# EAGLE design loom_motordriver (EAGLE 9.6.0)
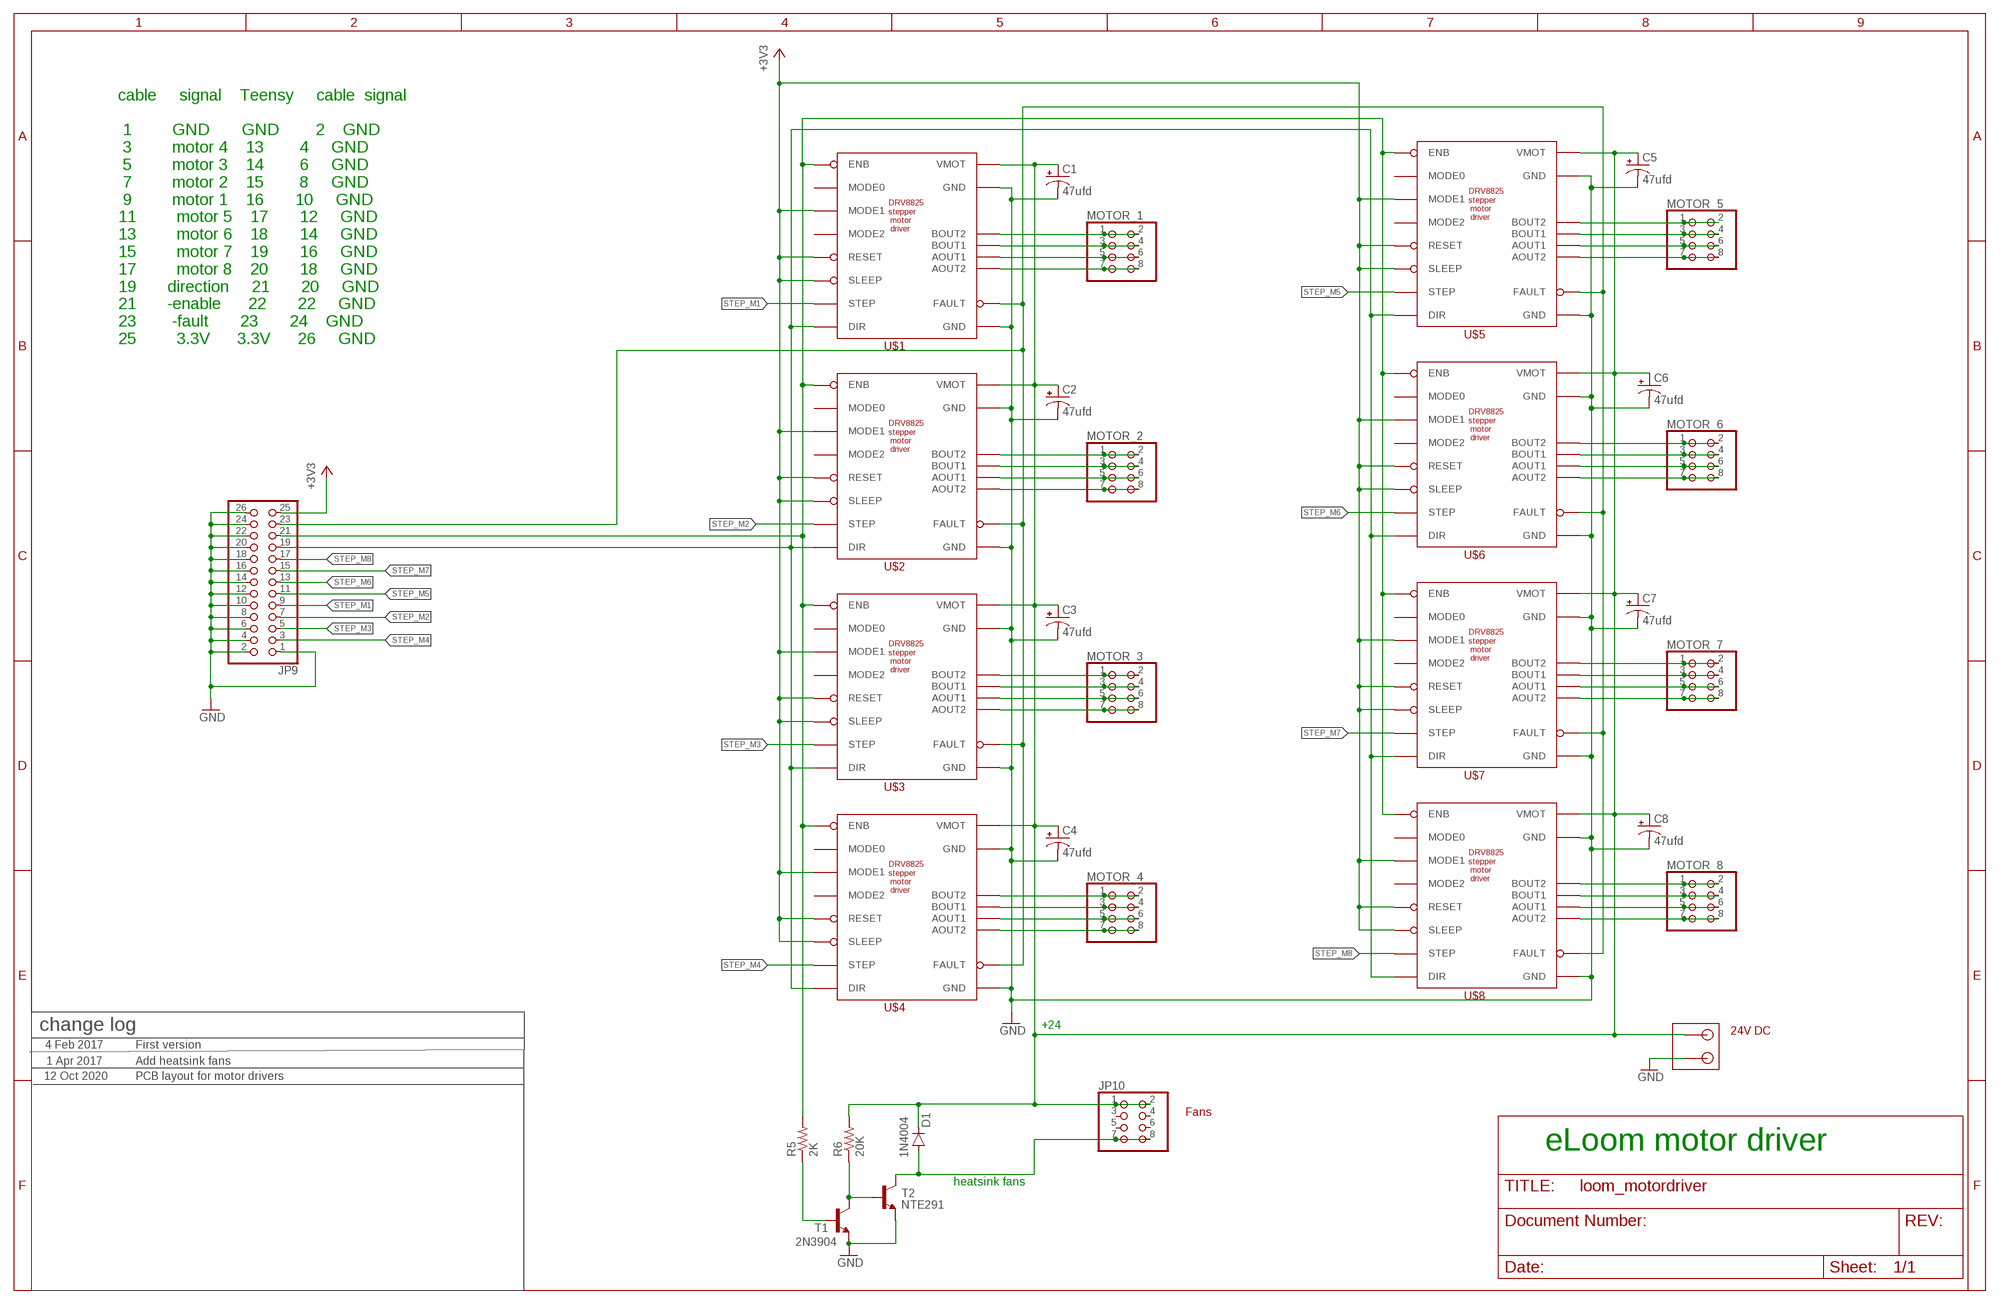
[diagram p0: schematic, sheet 1]

## Parts
C1  47ufd  CPOL-USE2.5-6  [E2,5-6]
C2  47ufd  CPOL-USE2.5-6  [E2,5-6]
C3  47ufd  CPOL-USE2.5-6  [E2,5-6]
C4  47ufd  CPOL-USE2.5-6  [E2,5-6]
C5  47ufd  CPOL-USE2.5-6  [E2,5-6]
C6  47ufd  CPOL-USE2.5-6  [E2,5-6]
C7  47ufd  CPOL-USE2.5-6  [E2,5-6]
C8  47ufd  CPOL-USE2.5-6  [E2,5-6]
D1  1N4004  [DO41-10]
JP9  PINHD-2X13  [2X13]
JP10  PINHD-2X4  [2X04]
MOTOR_1  PINHD-2X4  [2X04]
MOTOR_2  PINHD-2X4  [2X04]
MOTOR_3  PINHD-2X4  [2X04]
MOTOR_4  PINHD-2X4  [2X04]
MOTOR_5  PINHD-2X4  [2X04]
MOTOR_6  PINHD-2X4  [2X04]
MOTOR_7  PINHD-2X4  [2X04]
MOTOR_8  PINHD-2X4  [2X04]
R5  2K  R-US_0204/7  [0204/7]
R6  20K  R-US_0204/7  [0204/7]
T1  2N3904  [TO92]
T2  NTE291  -NPN-TO220  [TO220]
U$1  DRV8825_STEPPER_MOTOR_DRIVER  [DRV8825_STEPPER_MOTOR_DRIVER]
U$2  DRV8825_STEPPER_MOTOR_DRIVER  [DRV8825_STEPPER_MOTOR_DRIVER]
U$3  DRV8825_STEPPER_MOTOR_DRIVER  [DRV8825_STEPPER_MOTOR_DRIVER]
U$4  DRV8825_STEPPER_MOTOR_DRIVER  [DRV8825_STEPPER_MOTOR_DRIVER]
U$5  DRV8825_STEPPER_MOTOR_DRIVER  [DRV8825_STEPPER_MOTOR_DRIVER]
U$6  DRV8825_STEPPER_MOTOR_DRIVER  [DRV8825_STEPPER_MOTOR_DRIVER]
U$7  DRV8825_STEPPER_MOTOR_DRIVER  [DRV8825_STEPPER_MOTOR_DRIVER]
U$8  DRV8825_STEPPER_MOTOR_DRIVER  [DRV8825_STEPPER_MOTOR_DRIVER]
U$9  CONNECTOR-2PIN  [CONNECTOR-2PIN-5MM]

## Nets
24V [power]: C1.+ C2.+ C3.+ C4.+ C5.+ C6.+ C7.+ C8.+ D1.C JP10.1 JP10.2 R6.2 U$1.P$16(VMOT) U$2.P$16(VMOT) U$3.P$16(VMOT) U$4.P$16(VMOT) U$5.P$16(VMOT) U$6.P$16(VMOT) U$7.P$16(VMOT) U$8.P$16(VMOT) U$9.P$1
+3V3: JP9.25 U$1.P$3(MODE1) U$1.P$5(RESET) U$1.P$6(SLEEP) U$2.P$3(MODE1) U$2.P$5(RESET) U$2.P$6(SLEEP) U$3.P$3(MODE1) U$3.P$5(RESET) U$3.P$6(SLEEP) U$4.P$3(MODE1) U$4.P$5(RESET) U$4.P$6(SLEEP) U$5.P$3(MODE1) U$5.P$5(RESET) U$5.P$6(SLEEP) U$6.P$3(MODE1) U$6.P$5(RESET) U$6.P$6(SLEEP) U$7.P$3(MODE1) U$7.P$5(RESET) U$7.P$6(SLEEP) U$8.P$3(MODE1) U$8.P$5(RESET) U$8.P$6(SLEEP)
DIR: JP9.19 U$1.P$8(DIR) U$2.P$8(DIR) U$3.P$8(DIR) U$4.P$8(DIR) U$5.P$8(DIR) U$6.P$8(DIR) U$7.P$8(DIR) U$8.P$8(DIR)
ENB: JP9.21 R5.2 U$1.P$1(ENB) U$2.P$1(ENB) U$3.P$1(ENB) U$4.P$1(ENB) U$5.P$1(ENB) U$6.P$1(ENB) U$7.P$1(ENB) U$8.P$1(ENB)
FAN [power]: D1.A JP10.7 JP10.8 T2.2(C)
FAULT: JP9.23 U$1.P$10(FAULT) U$2.P$10(FAULT) U$3.P$10(FAULT) U$4.P$10(FAULT) U$5.P$10(FAULT) U$6.P$10(FAULT) U$7.P$10(FAULT) U$8.P$10(FAULT)
GND [power]: C1.- C2.- C3.- C4.- C5.- C6.- C7.- C8.- JP9.1 JP9.2 JP9.4 JP9.6 JP9.8 JP9.10 JP9.12 JP9.14 JP9.16 JP9.18 JP9.20 JP9.22 JP9.24 JP9.26 T1.3(E) T2.3(E) U$1.P$9(GND) U$1.P$15(GND) U$2.P$9(GND) U$2.P$15(GND) U$3.P$9(GND) U$3.P$15(GND) U$4.P$9(GND) U$4.P$15(GND) U$5.P$9(GND) U$5.P$15(GND) U$6.P$9(GND) U$6.P$15(GND) U$7.P$9(GND) U$7.P$15(GND) U$8.P$9(GND) U$8.P$15(GND) U$9.P$2
N$1 [power]: MOTOR_5.1 MOTOR_5.2 U$5.P$14(BOUT2)
N$2 [power]: MOTOR_5.3 MOTOR_5.4 U$5.P$13(BOUT1)
N$3 [power]: MOTOR_5.5 MOTOR_5.6 U$5.P$12(AOUT1)
N$4 [power]: MOTOR_5.7 MOTOR_5.8 U$5.P$11(AOUT2)
N$5 [power]: MOTOR_6.1 MOTOR_6.2 U$6.P$14(BOUT2)
N$6 [power]: MOTOR_6.3 MOTOR_6.4 U$6.P$13(BOUT1)
N$7 [power]: MOTOR_6.5 MOTOR_6.6 U$6.P$12(AOUT1)
N$8 [power]: MOTOR_6.7 MOTOR_6.8 U$6.P$11(AOUT2)
N$9 [power]: MOTOR_7.1 MOTOR_7.2 U$7.P$14(BOUT2)
N$10 [power]: MOTOR_7.3 MOTOR_7.4 U$7.P$13(BOUT1)
N$11 [power]: MOTOR_7.5 MOTOR_7.6 U$7.P$12(AOUT1)
N$12 [power]: MOTOR_7.7 MOTOR_7.8 U$7.P$11(AOUT2)
N$13 [power]: MOTOR_8.1 MOTOR_8.2 U$8.P$14(BOUT2)
N$14 [power]: MOTOR_8.3 MOTOR_8.4 U$8.P$13(BOUT1)
N$15 [power]: MOTOR_8.5 MOTOR_8.6 U$8.P$12(AOUT1)
N$16 [power]: MOTOR_8.7 MOTOR_8.8 U$8.P$11(AOUT2)
N$17 [power]: MOTOR_1.1 MOTOR_1.2 U$1.P$14(BOUT2)
N$21 [power]: MOTOR_1.3 MOTOR_1.4 U$1.P$13(BOUT1)
N$22 [power]: MOTOR_1.5 MOTOR_1.6 U$1.P$12(AOUT1)
N$23 [power]: MOTOR_1.7 MOTOR_1.8 U$1.P$11(AOUT2)
N$24 [power]: MOTOR_2.1 MOTOR_2.2 U$2.P$14(BOUT2)
N$25 [power]: MOTOR_2.3 MOTOR_2.4 U$2.P$13(BOUT1)
N$26 [power]: MOTOR_2.5 MOTOR_2.6 U$2.P$12(AOUT1)
N$27 [power]: MOTOR_2.7 MOTOR_2.8 U$2.P$11(AOUT2)
N$28 [power]: MOTOR_3.1 MOTOR_3.2 U$3.P$14(BOUT2)
N$29 [power]: MOTOR_3.3 MOTOR_3.4 U$3.P$13(BOUT1)
N$30 [power]: MOTOR_3.5 MOTOR_3.6 U$3.P$12(AOUT1)
N$31 [power]: MOTOR_3.7 MOTOR_3.8 U$3.P$11(AOUT2)
N$33: R5.1 T1.2(B)
N$34: R6.1 T1.1(C) T2.1(B)
N$37 [power]: MOTOR_4.1 MOTOR_4.2 U$4.P$14(BOUT2)
N$38 [power]: MOTOR_4.3 MOTOR_4.4 U$4.P$13(BOUT1)
N$39 [power]: MOTOR_4.5 MOTOR_4.6 U$4.P$12(AOUT1)
N$40 [power]: MOTOR_4.7 MOTOR_4.8 U$4.P$11(AOUT2)
STEP_M1: JP9.9 U$1.P$7(STEP)
STEP_M2: JP9.7 U$2.P$7(STEP)
STEP_M3: JP9.5 U$3.P$7(STEP)
STEP_M4: JP9.3 U$4.P$7(STEP)
STEP_M5: JP9.11 U$5.P$7(STEP)
STEP_M6: JP9.13 U$6.P$7(STEP)
STEP_M7: JP9.15 U$7.P$7(STEP)
STEP_M8: JP9.17 U$8.P$7(STEP)
Unconnected: JP10.3 JP10.4 JP10.5 JP10.6 U$1.P$2(MODE0) U$1.P$4(MODE2) U$2.P$2(MODE0) U$2.P$4(MODE2) U$3.P$2(MODE0) U$3.P$4(MODE2) U$4.P$2(MODE0) U$4.P$4(MODE2) U$5.P$2(MODE0) U$5.P$4(MODE2) U$6.P$2(MODE0) U$6.P$4(MODE2) U$7.P$2(MODE0) U$7.P$4(MODE2) U$8.P$2(MODE0) U$8.P$4(MODE2)

## Notes on the sheet
- cable     signal    Teensy     cable  signal
  
   1         GND       GND        2    GND  
   3         motor 4    13        4     GND
   5         motor 3    14        6     GND
   7         motor 2    15        8     GND
   9         motor 1    16       10     GND
  11         motor 5    17       12     GND
  13         motor 6    18       14     GND
  15         motor 7    19       16     GND
  17         motor 8    20       18     GND
  19       direction     21       20     GND
  21       -enable      22       22     GND
  23        -fault       23       24    GND
  25         3.3V      3.3V      26     GND
- change log | +24
- 24V DC
- 4 Feb 2017 | First version
- 1 Apr 2017 | Add heatsink fans
- 12 Oct 2020 | PCB layout for motor drivers
- Fans
- eLoom motor driver
- heatsink fans

## Library data of the parts
C1-C8 = adafruit:CPOL-US: POLARIZED CAPACITOR, American symbol
D1 = diode:1N4004: DIODE general purpose rectifier, 1 A
JP9 = pinhead:PINHD-2X13: PIN HEADER
JP10 = pinhead:PINHD-2X4: PIN HEADER
MOTOR_1-MOTOR_8 = adafruit:PINHD-2X4: PIN HEADER
R5 R6 = adafruit:R-US_: RESISTOR, American symbol
T1 = transistor:2N3904: NPN TRANSISTOR
T2 = transistor:*-NPN-: NPN Transistror BF959 corrected 2008.03.06
U$1-U$8 = Len:DRV8825_STEPPER_MOTOR_DRIVER
U$9 = Len:CONNECTOR-2PIN

## Net classes
1 power: width 1.524 mm

## Board
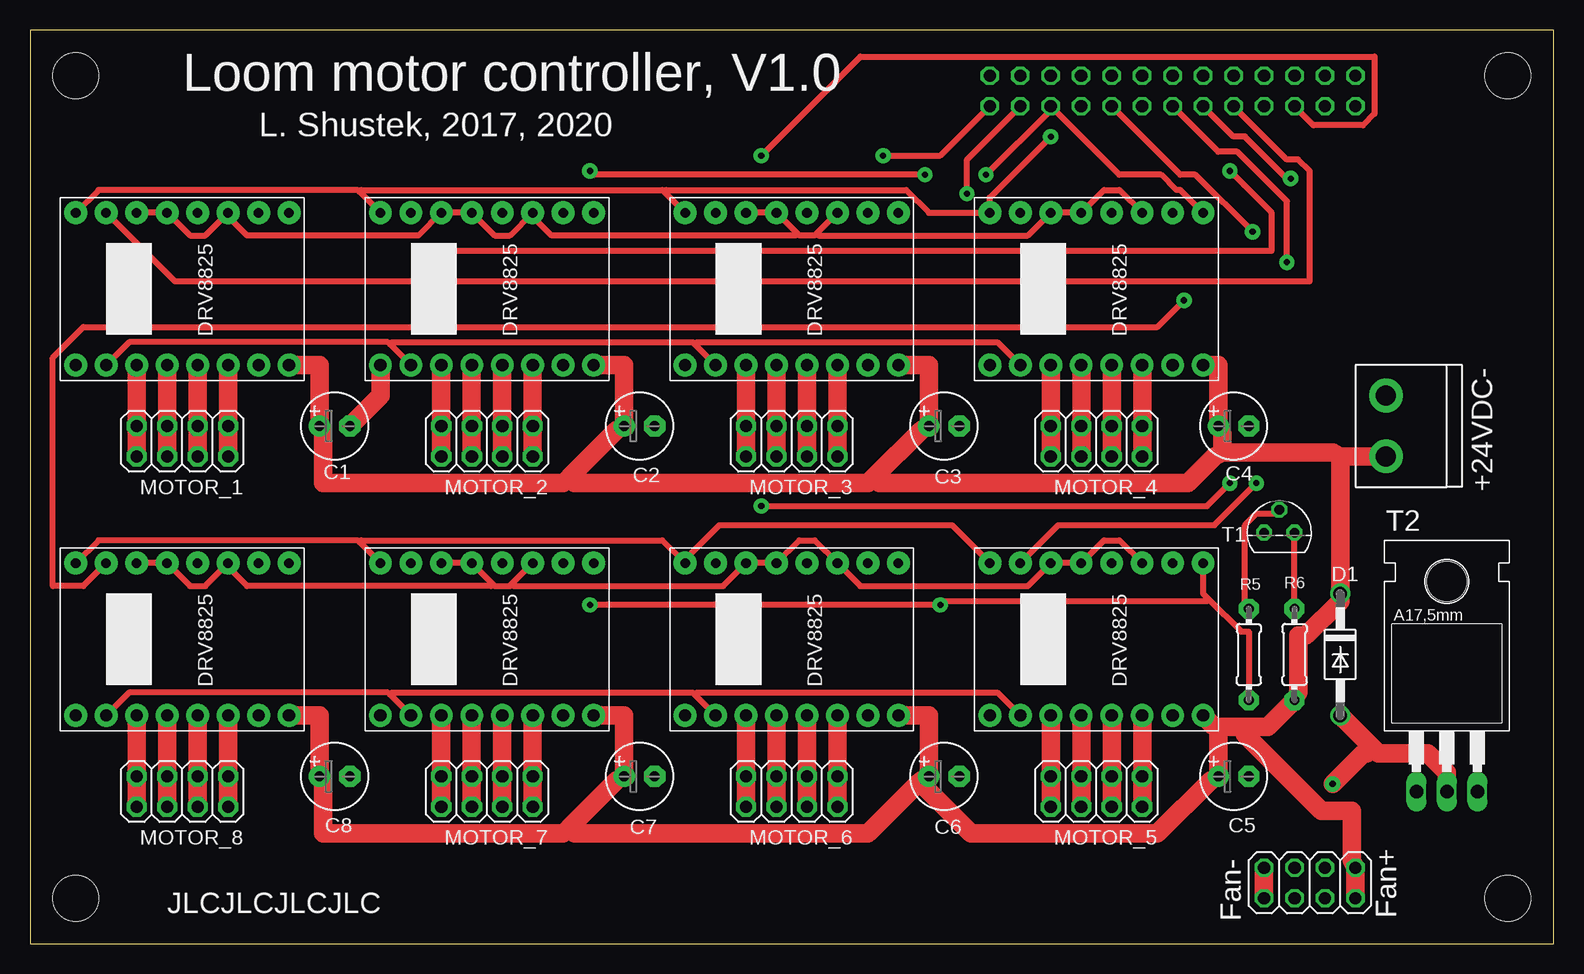
[diagram p1: board, top side]
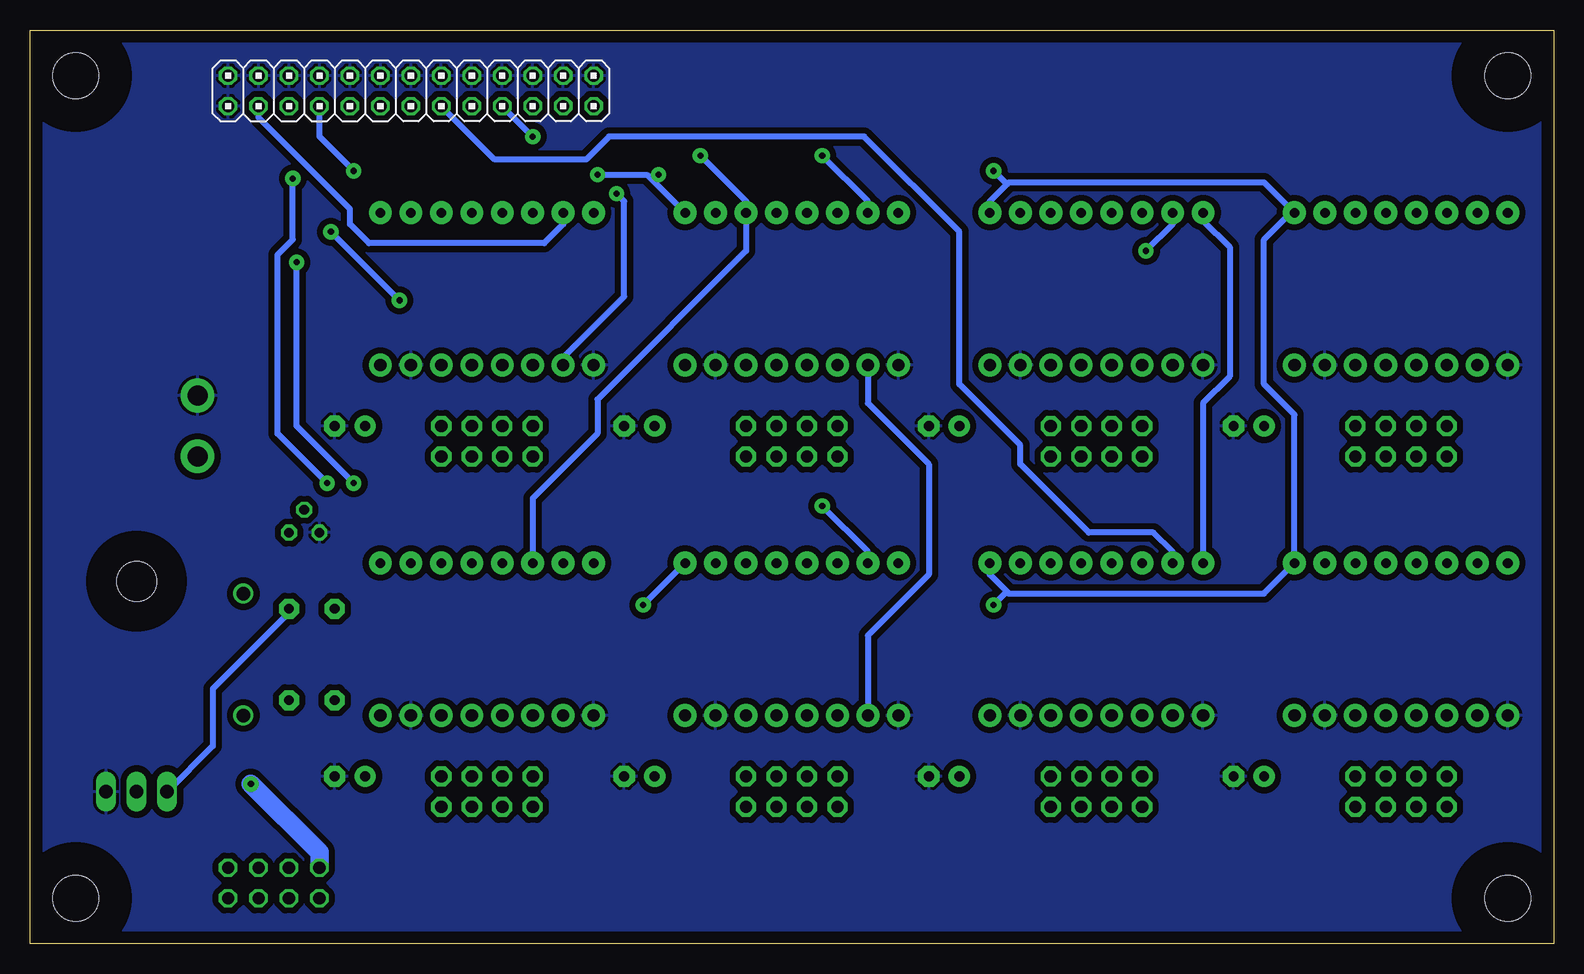
[diagram p2: board, bottom side, seen from below]

Size 127 x 76.2 mm. Coordinates in mm from the lower left corner, seen from the top.
Outline: 0,0 127,0 127,76.2 0,76.2 0,0
Copper layers (1*16): Top 0.035mm / dielectric 1.5mm / Bottom 0.035mm
Design rules "default *": minimum track width 20mil, minimum drill 20mil, track to track 20mil, track to pad 20mil, pad to pad 20mil, via to via 20mil, smd to smd 6mil, copper to edge 40mil, drill to drill 6mil, minimum pad ring 10mil, minimum via ring 15mil, stop-mask expansion 4mil, vias tented up to drill 0mil, thermal gap 10mil
Holes 3.81 mm at 3.81,3.81 3.81,72.39 123.19,72.39 123.19,3.81
tRestrict: area -0.8,67.8 to 8.4,77; area -0.8,-0.8 to 8.4,8.4; area 118.6,67.8 to 127.8,77; area 118.6,-0.8 to 127.8,8.4
bRestrict: area -0.8,67.8 to 8.4,77; area -0.8,-0.8 to 8.4,8.4; area 118.6,67.8 to 127.8,77; area 118.6,-0.8 to 127.8,8.4

### Footprints (pad centres in the part's own frame; a part is rotated, then mirrored left to right if it is on the bottom)
E2,5-6 = drill 0.813 pad 1.778: + -1.27,0 | drill 0.813 pad 1.778 octagon: - 1.27,0
DO41-10 = drill 1.118: A 5.08,0; C -5.08,0
2X13 = drill 1.016 octagon: 1 -15.24,-1.27; 2 -15.24,1.27; 3 -12.7,-1.27; 4 -12.7,1.27; 5 -10.16,-1.27; 6 -10.16,1.27; 7 -7.62,-1.27; 8 -7.62,1.27; 9 -5.08,-1.27; 10 -5.08,1.27; 11 -2.54,-1.27; 12 -2.54,1.27; 13 0,-1.27; 14 0,1.27; 15 2.54,-1.27; 16 2.54,1.27; 17 5.08,-1.27; 18 5.08,1.27; 19 7.62,-1.27; 20 7.62,1.27; 21 10.16,-1.27; 22 10.16,1.27; 23 12.7,-1.27; 24 12.7,1.27; 25 15.24,-1.27; 26 15.24,1.27
2X04 = drill 1.016 octagon: 1 -3.81,-1.27; 2 -3.81,1.27; 3 -1.27,-1.27; 4 -1.27,1.27; 5 1.27,-1.27; 6 1.27,1.27; 7 3.81,-1.27; 8 3.81,1.27
2X04' = drill 1.016 pad 1.676 octagon: 1 -3.81,-1.27; 2 -3.81,1.27; 3 -1.27,-1.27; 4 -1.27,1.27; 5 1.27,-1.27; 6 1.27,1.27; 7 3.81,-1.27; 8 3.81,1.27
0204/7 = drill 0.813 pad 1.676 octagon: 1 -3.81,0; 2 3.81,0
TO92 = drill 0.813 octagon: 1 1.27,0; 2 0,1.905; 3 -1.27,0
TO220 = drill 1.118 long: 1 -2.54,-6.35; 2 0,-6.35; 3 2.54,-6.35 | hole 3.302: 0,11.176
DRV8825_STEPPER_MOTOR_DRIVER = drill 0.8 pad 1.905: P$1 -6.35,8.89; P$2 -6.35,6.35; P$3 -6.35,3.81; P$4 -6.35,1.27; P$5 -6.35,-1.27; P$6 -6.35,-3.81; P$7 -6.35,-6.35; P$8 -6.35,-8.89 | drill 1.016 pad 1.905: P$9 6.35,-8.89; P$10 6.35,-6.35; P$11 6.35,-3.81; P$12 6.35,-1.27; P$13 6.35,1.27; P$14 6.35,3.81; P$15 6.35,6.35; P$16 6.35,8.89
CONNECTOR-2PIN-5MM = drill 1.651 pad 2.794: P$1 0,2.54; P$2 0,-2.54

### Placement (x,y rotation side)
C1  25.4,43.18 0 top
C2  50.8,43.18 0 top
C3  76.2,43.18 0 top
C4  100.33,43.18 0 top
C5  100.33,13.97 0 top
C6  76.2,13.97 0 top
C7  50.8,13.97 0 top
C8  25.4,13.97 0 top
D1  109.22,24.13 270 top
JP9  95.25,71.12 0 bottom
JP10  106.68,5.08 180 top
MOTOR_1  [2X04']  12.7,41.91 180 top
MOTOR_2  [2X04']  38.1,41.91 180 top
MOTOR_3  [2X04']  63.5,41.91 180 top
MOTOR_4  [2X04']  88.9,41.91 180 top
MOTOR_5  [2X04']  88.9,12.7 180 top
MOTOR_6  [2X04']  63.5,12.7 180 top
MOTOR_7  [2X04']  38.1,12.7 180 top
MOTOR_8  [2X04']  12.7,12.7 180 top
R5  101.6,24.13 270 top
R6  105.41,24.13 270 top
T1  104.14,34.29 0 top
T2  118.11,19.05 0 top
U$1  12.7,54.61 270 top
U$2  38.1,54.61 270 top
U$3  63.5,54.61 270 top
U$4  88.9,54.61 270 top
U$5  88.9,25.4 270 top
U$6  63.5,25.4 270 top
U$7  38.1,25.4 270 top
U$8  12.7,25.4 270 top
U$9  113.03,43.18 180 top

### Tracks (layer width: path | path; a pad name or v marks a point on that pad's centre or on a via)
24V
  Top 1.524: U$6.P$16 74.93,19.05 C6.+ 74.3,13.65 74.14,13.49 | U$8.P$16 24.13,19.05 C8.+ 24.45,13.34 24.45,9.21 44.45,9.21 44.93,9.68 | U$7.P$16 49.53,19.05 C7.+ 48.9,13.65 44.93,9.68 | 74.14,13.49 69.85,9.21 45.4,9.21 44.93,9.68 | JP10.2 JP10.1 110.17,6.99 110.17,11.11 107.63,11.11 101.28,17.46 101.28,18.1 | 99.06,18.1 98.74,18.1 U$5.P$16 | 99.06,18.1 101.28,18.1 | 101.28,18.1 103.19,18.1 R6.2 105.73,20.95 105.73,25.72 106.36,25.72 109.22,28.57 D1.C 109.22,40.64 | 99.06,18.1 C5.+ 98.42,13.65 93.98,9.21 78.42,9.21 74.14,13.49 | U$4.P$16 99.06,48.26 C4.+ 99.38,42.55 99.38,40.96 | U$9.P$1 109.22,40.64 | 99.38,40.96 108.58,40.96 109.22,40.64 | U$3.P$16 74.93,48.26 C3.+ 74.3,42.86 70.33,38.89 | U$1.P$16 24.13,48.26 C1.+ 24.45,42.55 24.45,38.42 44.45,38.42 44.93,38.89 | U$2.P$16 49.53,48.26 C2.+ 48.9,42.86 44.93,38.89 | 70.33,38.89 69.85,38.42 45.4,38.42 44.93,38.89 | 99.38,40.96 98.74,40.64 96.52,38.42 70.8,38.42 70.33,38.89
+3V3  (via drill 0.51)
  Top 0.508: U$5.P$3 90.81,33.66 89.53,33.66 U$5.P$5 U$5.P$6 83.19,29.84 69.22,29.84 U$6.P$3 65.41,33.66 64.14,33.66 U$6.P$5 U$6.P$6 57.78,29.84 40.32,29.84 40.16,30 | U$8.P$6 U$8.P$5 13.34,29.84 14.61,29.84 U$8.P$3 16.51,31.43 18.1,29.84 38.42,29.84 38.58,30 | U$7.P$6 U$7.P$5 38.58,30 | 40.16,30 40.01,29.84 38.73,29.84 38.58,30 | 40.16,30 U$7.P$3 | U$1.P$6 U$1.P$5 13.34,59.05 14.61,59.05 U$1.P$3 16.51,60.64 18.1,59.05 32.38,59.05 U$2.P$6 U$2.P$5 38.73,59.05 40.01,59.05 U$2.P$3 41.91,60.64 43.5,59.05 63.82,59.05 63.98,59.21 | U$4.P$3 90.81,62.87 89.53,62.87 U$4.P$5 U$4.P$6 83.19,59.05 65.72,59.05 65.56,59.21 | U$3.P$6 U$3.P$5 63.98,59.21 | JP9.25 75.88,65.72 v71.12,65.72 | 63.98,59.21 64.14,59.05 65.41,59.05 65.56,59.21 | U$3.P$3 65.56,59.21
  Bottom 0.508: v71.12,65.72 67.31,61.91 U$3.P$3 67.31,57.78 79.69,45.4 79.69,42.55 85.09,37.15 U$5.P$6
DIR  (via drill 0.51)
  Top 0.508: U$8.P$8 5.71,33.66 27.3,33.66 27.46,33.5 | U$7.P$8 27.46,33.5 | 27.46,33.5 27.62,33.66 52.7,33.66 U$6.P$8 54.61,32.07 57.47,34.92 76.83,34.92 U$5.P$8 | v85.09,67.31 80.01,62.23 U$4.P$8 74.93,60.96 73.03,62.87 53.02,62.87 52.86,62.71 | U$1.P$8 5.71,62.87 27.3,62.87 27.46,62.71 | U$2.P$8 27.46,62.71 | 52.86,62.71 52.7,62.87 27.62,62.87 27.46,62.71 | 52.86,62.71 U$3.P$8
  Bottom 0.508: v85.09,67.31 JP9.19 | U$7.P$8 29.21,45.09 26.99,47.31 26.99,58.1 29.21,60.33 U$2.P$8
ENB  (via drill 0.51)
  Top 0.508: U$4.P$1 95.89,62.87 95.57,62.87 94.3,64.14 90.81,64.14 JP9.21 85.09,69.53 v79.69,64.14 | v46.67,64.45 46.99,64.14 v74.61,64.14 | R5.2 101.6,26.04 100.97,26.04 98.27,28.73 | 98.27,28.73 97.79,29.21 U$5.P$1 | 98.27,28.73 98.11,28.57 76.2,28.57 v75.88,28.26 v46.67,28.26
  Bottom 0.508: 45.56,63.34 46.99,61.91 U$2.P$1 | 45.56,63.34 45.4,63.5 24.13,63.5 U$1.P$1 21.91,60.96 24.13,58.74 24.13,46.67 21.59,44.13 U$8.P$1 24.13,29.21 45.4,29.21 45.56,29.37 | 75.09,63.66 75.56,64.14 v79.69,64.14 | 75.09,63.66 U$3.P$1 | v46.67,64.45 45.56,63.34 | 75.09,63.66 v74.61,64.14 | 45.56,29.37 46.99,30.8 U$7.P$1 | v75.88,28.26 U$6.P$1 | v46.67,28.26 45.56,29.37
FAN  (via drill 0.51)
  Top 1.524: JP10.7 JP10.8 | 111.92,16.35 112.39,15.88 116.52,15.88 118.11,14.29 T2.2 | 111.92,16.35 D1.A | v108.58,13.34 111.12,15.88 111.44,15.88 111.92,16.35
  Bottom 1.524: JP10.7 102.87,7.62 v108.58,13.34
FAULT  (via drill 0.51)
  Top 0.508: U$8.P$10 8.26,20.95 29.84,20.95 30,20.8 | U$7.P$10 30,20.8 | 55.4,20.8 55.24,20.95 30.16,20.95 30,20.8 | 55.4,20.8 U$6.P$10 | U$5.P$10 80.64,20.95 55.56,20.95 55.4,20.8 | JP9.23 78.11,65.41 v78.11,62.55 | U$1.P$10 8.26,50.16 29.84,50.16 30,50.01 | U$2.P$10 30,50.01 | 55.4,50.01 55.24,50.16 30.16,50.16 30,50.01 | 55.4,50.01 U$3.P$10 | U$4.P$10 80.64,50.16 55.56,50.16 55.4,50.01
  Bottom 0.508: v78.11,62.55 77.47,61.91 77.47,53.98 82.55,48.9 U$4.P$10 | U$6.P$10 57.15,25.72 52.07,30.8 52.07,40.01 57.15,45.09 U$3.P$10
GND
  Top 1.524: U$2.P$9 29.21,45.72 C1.-
  pour Bottom: -2.54,78.74 130.81,78.74 130.81,-2.54 -2.54,-2.54
N$1
  Top 1.524: MOTOR_5.2 MOTOR_5.1 U$5.P$14
N$2
  Top 1.524: MOTOR_5.4 MOTOR_5.3 U$5.P$13
N$3
  Top 1.524: MOTOR_5.6 MOTOR_5.5 U$5.P$12
N$4
  Top 1.524: MOTOR_5.8 MOTOR_5.7 U$5.P$11
N$5
  Top 1.524: MOTOR_6.2 MOTOR_6.1 U$6.P$14
N$6
  Top 1.524: MOTOR_6.4 MOTOR_6.3 U$6.P$13
N$7
  Top 1.524: MOTOR_6.6 MOTOR_6.5 U$6.P$12
N$8
  Top 1.524: MOTOR_6.8 MOTOR_6.7 U$6.P$11
N$9
  Top 1.524: MOTOR_7.2 MOTOR_7.1 U$7.P$14
N$10
  Top 1.524: MOTOR_7.4 MOTOR_7.3 U$7.P$13
N$11
  Top 1.524: MOTOR_7.6 MOTOR_7.5 U$7.P$12
N$12
  Top 1.524: MOTOR_7.8 MOTOR_7.7 U$7.P$11
N$13
  Top 1.524: MOTOR_8.2 MOTOR_8.1 U$8.P$14
N$14
  Top 1.524: MOTOR_8.4 MOTOR_8.3 U$8.P$13
N$15
  Top 1.524: MOTOR_8.6 MOTOR_8.5 U$8.P$12
N$16
  Top 1.524: MOTOR_8.8 MOTOR_8.7 U$8.P$11
N$17
  Top 1.524: MOTOR_1.2 MOTOR_1.1 U$1.P$14
N$21
  Top 1.524: MOTOR_1.4 MOTOR_1.3 U$1.P$13
N$22
  Top 1.524: MOTOR_1.6 MOTOR_1.5 U$1.P$12
N$23
  Top 1.524: MOTOR_1.8 MOTOR_1.7 U$1.P$11
N$24
  Top 1.524: MOTOR_2.2 MOTOR_2.1 U$2.P$14
N$25
  Top 1.524: MOTOR_2.4 MOTOR_2.3 U$2.P$13
N$26
  Top 1.524: MOTOR_2.6 MOTOR_2.5 U$2.P$12
N$27
  Top 1.524: MOTOR_2.8 MOTOR_2.7 U$2.P$11
N$28
  Top 1.524: MOTOR_3.2 MOTOR_3.1 U$3.P$14
N$29
  Top 1.524: MOTOR_3.4 MOTOR_3.3 U$3.P$13
N$30
  Top 1.524: MOTOR_3.6 MOTOR_3.5 U$3.P$12
N$31
  Top 1.524: MOTOR_3.8 MOTOR_3.7 U$3.P$11
N$33
  Top 0.508: T1.2 103.82,35.88 102.23,35.88 101.28,34.92 101.28,27.94 R5.1
N$34
  Top 0.508: R6.1 T1.1
  Bottom 0.508: T2.1 111.76,16.51 111.76,21.27 105.41,27.62 R6.1
N$37
  Top 1.524: MOTOR_4.2 MOTOR_4.1 U$4.P$14
N$38
  Top 1.524: MOTOR_4.4 MOTOR_4.3 U$4.P$13
N$39
  Top 1.524: MOTOR_4.6 MOTOR_4.5 U$4.P$12
N$40
  Top 1.524: MOTOR_4.8 MOTOR_4.7 U$4.P$11
STEP_M1
  Top 0.508: JP9.9 104.78,65.41 105.73,65.41 106.68,64.45 106.68,55.24 12.06,55.24 U$1.P$7
STEP_M2  (via drill 0.51)
  Top 0.508: v100.01,64.45 103.5,60.96 103.5,57.78 v33.97,57.78
  Bottom 0.508: JP9.7 102.87,67.31 v100.01,64.45 | v33.97,57.78 31.75,60.01 U$2.P$7
STEP_M3  (via drill 0.51)
  Top 0.508: JP9.5 107,68.26 111.12,68.26 112.08,69.22 112.08,73.98 69.22,73.98 v60.96,65.72
  Bottom 0.508: v60.96,65.72 57.15,61.91 U$3.P$7
STEP_M4
  Bottom 0.508: JP9.3 107.95,68.9 100.33,61.28 100.33,60.01 98.74,58.42 84.14,58.42 82.55,60.01 U$4.P$7
STEP_M5  (via drill 0.51)
  Top 0.508: JP9.11 100.33,67.31 101.28,67.31 104.78,63.82 v105.09,63.82 | v102.23,38.42 98.74,34.92 85.72,34.92 U$5.P$7
  Bottom 0.508: v105.09,63.82 105.09,58.74 106.36,57.47 106.36,42.55 v102.23,38.42
STEP_M6  (via drill 0.51)
  Top 0.508: JP9.13 99.06,66.04 100.65,66.04 104.78,61.91 v104.78,56.83 | v100.01,38.42 98.11,36.51 v60.96,36.51
  Bottom 0.508: v104.78,56.83 104.78,43.18 v100.01,38.42 | v60.96,36.51 57.15,32.7 U$6.P$7
STEP_M7
  Bottom 0.508: JP9.15 88.27,65.41 80.64,65.41 78.74,67.31 57.47,67.31 49.53,59.37 49.53,46.67 44.45,41.59 44.45,40.01 38.73,34.29 33.34,34.29 31.75,32.7 U$7.P$7
STEP_M8  (via drill 0.51)
  Top 0.508: JP9.17 95.89,64.14 97.16,64.14 v101.92,59.37 | v96.2,53.66 93.98,51.44 4.45,51.44 1.91,48.9 1.91,29.84 4.45,29.84 U$8.P$7
  Bottom 0.508: v96.2,53.66 v101.92,59.37

### Text on the board
tPlace: Loom motor controller, V1.0 | L. Shustek, 2017, 2020 | +24VDC- | JLCJLCJLCJLC | Fan- | Fan+